# EAGLE board AQ_sensor_GSM (EAGLE 9.6.2)
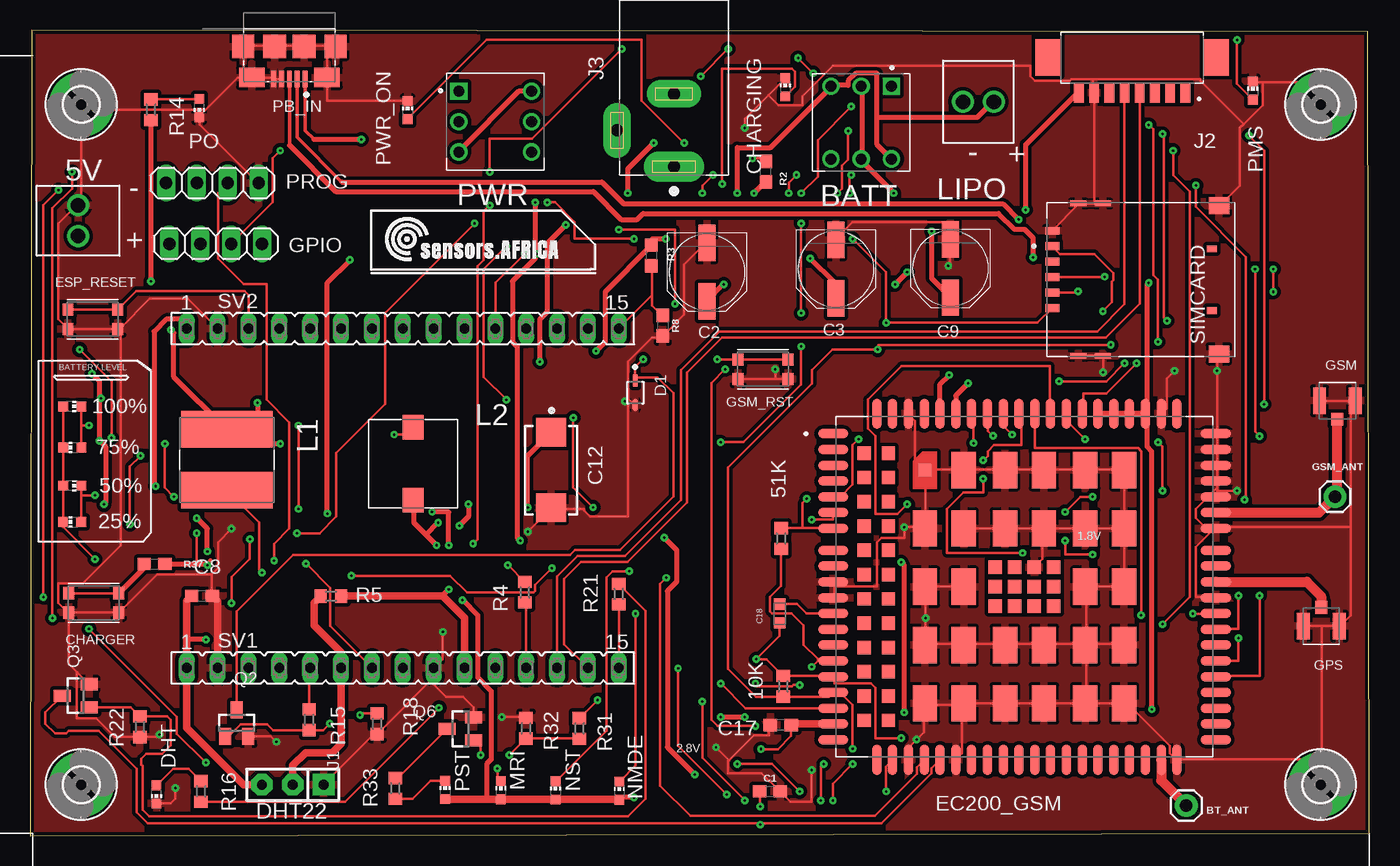
[diagram p5: board, top side]
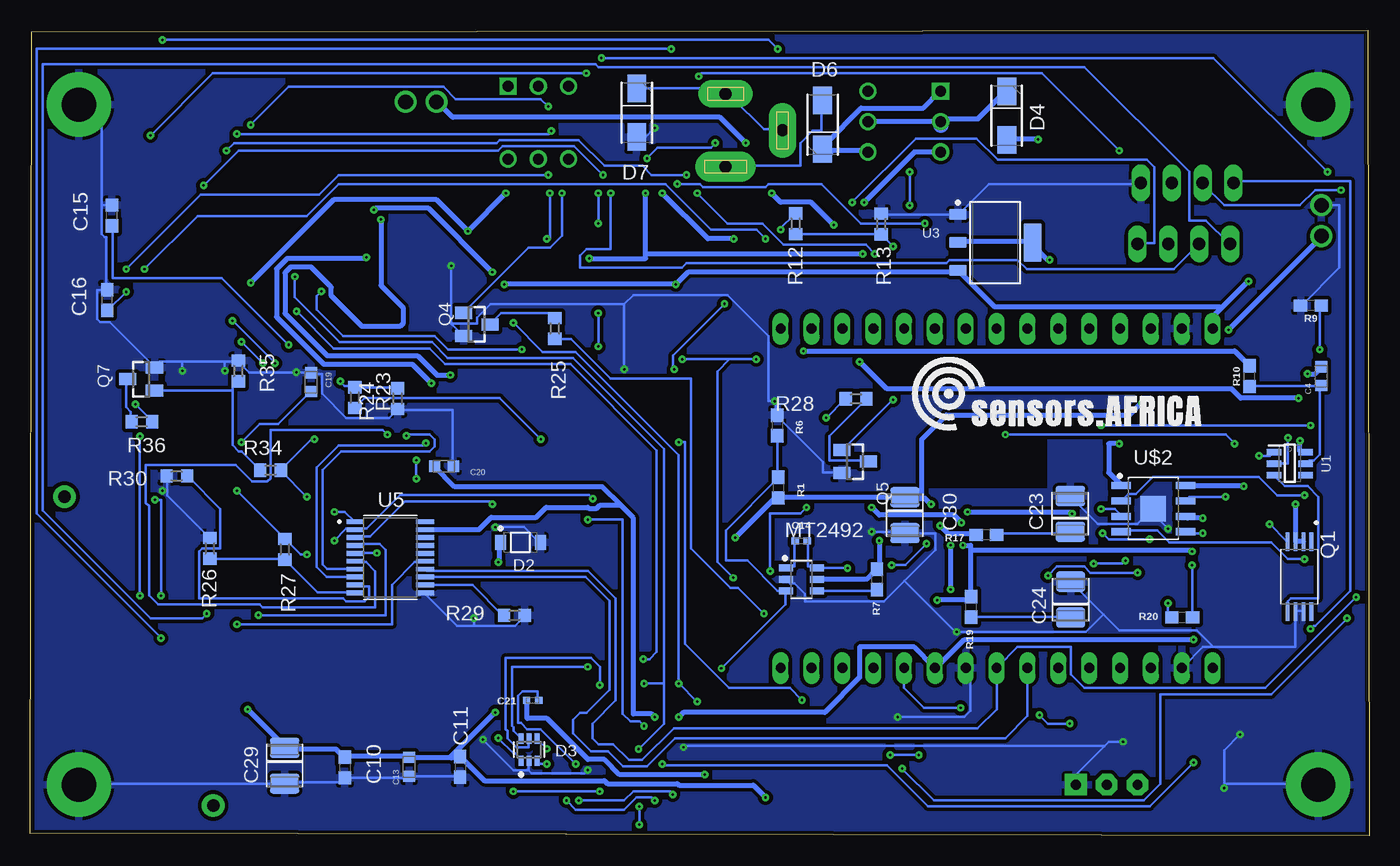
[diagram p6: board, bottom side, seen from below]

Size 110.2 x 66.3 mm. Coordinates in mm from the lower left corner, seen from the top.
Outline: 110.1,66.2 0.1,66.3 0,0 110.2,0.2 110.1,66.2
Copper layers (1*16): Top 0.035mm / dielectric 1.5mm / Bottom 0.035mm
Design rules "default *": minimum track width 0.1mm, minimum drill 0.15mm, track to track 0.3mm, track to pad 0.1mm, pad to pad 0.2mm, via to via 0.3mm, smd to smd 0.3mm, copper to edge 0.3mm, drill to drill 0.3mm, minimum pad ring 10mil, minimum via ring 8mil, stop-mask expansion 4mil, vias tented up to drill 0mil, thermal gap 10mil
Net classes: 0 default: width 0.2 mm, drill 0.2 mm, clearance 0.2 mm; 1 POWER: width 0.4 mm, drill 0.2 mm, clearance 0.2 mm to class 0, clearance 0.2 mm; 2 BGA: width 0.2 mm, drill 0.2 mm; 3 HCurrent: width 0.4 mm, drill 0.2 mm, clearance 0.2 mm to class 0

## Footprints (pad centres in the part's own frame; a part is rotated, then mirrored left to right if it is on the bottom)
TERMBLK_254-2N = drill 1.2: 1 0,0; 2 2.54,0
R0603 = smd 1 x 1.1: 1 -0.85,0; 2 0.85,0
CHIP-LED0603 = smd 0.8 x 0.8: A 0,-0.75; C 0,0.75
SW_TL2285EE = drill 0.9 square: 1 -2.5,-3 | drill 0.9: 2 0,-3; 3 2.5,-3; 4 -2.5,3; 5 0,3; 6 2.5,3
1X01 = drill 1.016 pad 1.88: 1 0,0
0603 = smd 1.1 x 1: 1 -0.85,0; 2 0.85,0
PANASONIC_D = smd 3 x 1.4: + 2.4,0; - -2.4,0
CAPC1608X90N = smd 0.92 x 0.98: 1 -0.775,0; 2 0.775,0
C0603 = smd 1.1 x 1: 1 -0.85,0; 2 0.85,0
CAPMP7343X430N = smd 2.35 x 2.45: 1 -3.1,0; 2 3.1,0
0402-TIGHT = smd 0.6 x 0.6: 1 -0.5,0; 2 0.5,0
CAP_TANT_B = smd 1.66 x 2.42: 1 -1.475,0; 2 1.475,0
SW_KMR621NGLFS = smd 0.9 x 1: 1_1 -2.05,0.8; 1_2 2.05,0.8; 2_1 -2.05,-0.8; 2_2 2.05,-0.8
ON_SEMI_1N4148WS_0 = smd 1.006 x 0.392: 1 -1,0; 2 1,0
ON_SEMICONDUCTOR_MMSZ5231BT1G_0 = smd 0.91 x 1.22: 1 -1.635,0; 2 1.635,0
SEMTECH_SMF05C_0 = smd 0.85 x 0.4: 1 -0.925,0.65; 2 -0.925,0; 3 -0.925,-0.65; 4 0.925,-0.65; 5 0.925,0; 6 0.925,0.65
DIOM5025X220N = smd 2.25 x 1.55: 1 -2,0; 2 2,0
XCVR_EC200UCNAB-N05-SNNSA = smd 2.5 x 0.8: 1 -15.75,12.6; 2 -15.75,11.3; 3 -15.75,10; 4 -15.75,8.7; 5 -15.75,7.4; 6 -15.75,6.1; 7 -15.75,4.8; 8 -15.75,0.4; 9 -15.75,-0.9; 10 -15.75,-2.2; 11 -15.75,-3.5; 12 -15.75,-4.8; 13 -15.75,-6.1; 14 -15.75,-7.4; 15 -15.75,-8.7; 16 -15.75,-10; 17 -15.75,-11.3; 18 -15.75,-12.6; 37 15.75,-12.6; 38 15.75,-11.3; 39 15.75,-10; 40 15.75,-8.7; 41 15.75,-7.4; 42 15.75,-6.1; 43 15.75,-4.8; 44 15.75,-3.5; 45 15.75,-2.2; 46 15.75,-0.9; 47 15.75,0.4; 48 15.75,4.8; 49 15.75,6.1; 50 15.75,7.4; 51 15.75,8.7; 52 15.75,10; 53 15.75,11.3; 54 15.75,12.6; 141 -15.75,3; 142 -15.75,1.7; 143 15.75,1.7; 144 15.75,3 | smd 0.8 x 2.5: 19 -9.55,-14.25; 20 -8.25,-14.25; 21 -6.95,-14.25; 22 -5.65,-14.25; 23 -4.35,-14.25; 24 -3.05,-14.25; 25 -1.75,-14.25; 26 -0.45,-14.25; 27 0.85,-14.25; 28 2.15,-14.25; 29 3.45,-14.25; 30 4.75,-14.25; 31 6.05,-14.25; 32 7.35,-14.25; 33 8.65,-14.25; 34 9.95,-14.25; 35 11.25,-14.25; 36 12.55,-14.25; 55 12.55,14.25; 56 11.25,14.25; 57 9.95,14.25; 58 8.65,14.25; 59 7.35,14.25; 60 6.05,14.25; 61 4.75,14.25; 62 3.45,14.25; 63 2.15,14.25; 64 0.85,14.25; 65 -0.45,14.25; 66 -1.75,14.25; 67 -3.05,14.25; 68 -4.35,14.25; 69 -5.65,14.25; 70 -6.95,14.25; 71 -8.25,14.25; 72 -9.55,14.25; 113 -10.85,14.25; 114 -12.15,14.25; 115 -10.85,-14.25; 116 -12.15,-14.25 | smd 1.1 x 1.1: 73 2.4,1.6; 74 2.4,0; 75 2.4,-1.6; 76 0.8,1.6; 77 0.8,0; 78 0.8,-1.6; 79 -0.8,1.6; 80 -0.8,0; 81 -0.8,-1.6; 82 -2.4,1.6; 83 -2.4,0; 84 -2.4,-1.6; 117 -11.2,11; 118 -11.2,9; 119 -11.2,7; 120 -11.2,5; 121 -11.2,3; 122 -11.2,1; 123 -11.2,-1; 124 -11.2,-3; 125 -11.2,-5; 126 -11.2,-7; 127 -11.2,-9; 128 -11.2,-11; 129 -13.2,11; 130 -13.2,9; 131 -13.2,7; 132 -13.2,5; 133 -13.2,3; 134 -13.2,1; 135 -13.2,-1; 136 -13.2,-3; 137 -13.2,-5; 138 -13.2,-7; 139 -13.2,-9; 140 -13.2,-11 | smd 2 x 3: 85 8.2,9.6; 86 8.2,4.8; 87 8.2,0; 88 8.2,-4.8; 89 8.2,-9.6; 90 5,9.6; 91 5,4.8; 92 5,0; 93 5,-4.8; 94 5,-9.6; 95 1.6,9.6; 96 1.6,4.8; 97 1.6,-4.8; 98 1.6,-9.6; 99 -1.6,9.6; 100 -1.6,4.8; 101 -1.6,-4.8; 102 -1.6,-9.6; 103 -5,9.6; 104 -5,4.8; 105 -5,0; 106 -5,-4.8; 107 -5,-9.6; 109 -8.2,4.8; 110 -8.2,0; 111 -8.2,-4.8; 112 -8.2,-9.6 | smd 1 x 1: 108 -8.2,9.6
1X04 = drill 1.016 long: 1 -3.81,0; 2 -1.27,0; 3 1.27,0; 4 3.81,0
TE_1909763-1 = smd 1 x 1.05: 1 0,-1.525 | smd 1.05 x 2.2: 2 -1.475,0; 3 1.475,0
2,8-PAD = drill 2.8 pad 5.334: B2,8 0,0
SIP-100-03-32 = drill 0.813 pad 1.778 square: 1 -2.54,0 | drill 0.813 pad 1.778 octagon: 2 0,0; 3 2.54,0
MOLEX_53261-0871 = smd 0.8 x 1.6: 1 -4.375,2.9; 2 -3.125,2.9; 3 -1.875,2.9; 4 -0.625,2.9; 5 0.625,2.9; 6 1.875,2.9; 7 3.125,2.9; 8 4.375,2.9 | smd 2.1 x 3: S1 -6.925,0; S2 6.925,0
CUI_PJ-002BH = drill 1 pad 2.5 long: 1 0,0 | drill 1 pad 2.25 long: 2 6,0; 3 3,4.7
784787047 = smd 7.5 x 3: 1 0,2.5; 2 0,-2.5
784778010 = smd 1.7 x 2: 1 0,3; 2 0,-3
SOT95P280X145-6N = smd 1.172 x 0.589: 1 -1.272,0.95; 2 -1.272,0; 3 -1.272,-0.95; 4 1.272,-0.95; 5 1.272,0; 6 1.272,0.95
AMPHENOL_10118192-0001LF = smd 0.4 x 1.35: 1 -1.3,0; 2 -0.65,0; 3 0,0; 4 0.65,0; 5 1.3,0 | smd 2.1 x 1.6: SH1 -3.1,-0.125; SH2 3.1,-0.125 | smd 1.8 x 1.9: SH3 -3.8,-2.675; SH6 3.8,-2.675 | smd 1.9 x 1.9: SH4 -1.2,-2.675; SH5 1.2,-2.675
SOP65P640X120-8N = smd 1.56 x 0.4: 1 -2.88,0.975; 2 -2.88,0.325; 3 -2.88,-0.325; 4 -2.88,-0.975; 5 2.88,-0.975; 6 2.88,-0.325; 7 2.88,0.325; 8 2.88,0.975
SOT23-BEC = smd 1 x 1.4: B -0.95,-1.1; C 0,1.1; E 0.95,-1.1
MOLEX_78646-3001 = smd 1.15 x 0.65: C1 -7.295,2.755; C2 -7.295,0.215; C3 -7.295,-2.325; C5 -7.295,4.025; C6 -7.295,1.485; C7 -7.295,-1.055 | smd 1.3 x 0.45: G1 -5.125,6.27; G2 -3.125,6.27; G3 -5.125,-6.27; G4 -3.125,-6.27 | smd 1.7 x 1.4: G5 6.435,-6.105; G6 6.435,6.105 | smd 0.8 x 0.54: X1 5.855,2.54; X2 5.855,-2.54
FE15 = drill 0.813 long: 1 -17.78,0; 2 -15.24,0; 3 -12.7,0; 4 -10.16,0; 5 -7.62,0; 6 -5.08,0; 7 -2.54,0; 8 0,0; 9 2.54,0; 10 5.08,0; 11 7.62,0; 12 10.16,0; 13 12.7,0; 14 15.24,0; 15 17.78,0
SOT23-6L = smd 0.55 x 1.2: 1 -0.95,-1.3; 2 0,-1.3; 3 0.95,-1.3; 4 0.95,1.3; 5 0,1.3; 6 -0.95,1.3
TEXAS_INSTRUMENTS_LM1117IMP-3.3-NOPB_0 = smd 1.45 x 0.9: 1 -3.075,2.3; 2 -3.075,0; 3 -3.075,-2.3 | smd 1.45 x 3.15: 4 3.075,0
SOP65P640X120-20N = smd 1.57 x 0.41: 1 -2.87,2.925; 2 -2.87,2.275; 3 -2.87,1.625; 4 -2.87,0.975; 5 -2.87,0.325; 6 -2.87,-0.325; 7 -2.87,-0.975; 8 -2.87,-1.625; 9 -2.87,-2.275; 10 -2.87,-2.925; 11 2.87,-2.925; 12 2.87,-2.275; 13 2.87,-1.625; 14 2.87,-0.975; 15 2.87,-0.325; 16 2.87,0.325; 17 2.87,0.975; 18 2.87,1.625; 19 2.87,2.275; 20 2.87,2.925
SOIC127P600X165-9T209N = smd 1.609 x 0.594: 1 -2.653,1.905; 2 -2.653,0.635; 3 -2.653,-0.635; 4 -2.653,-1.905; 5 2.653,-1.905; 6 2.653,-0.635; 7 2.653,0.635; 8 2.653,1.905 | smd 2.09 x 2.09: 9 0,0

## Placement (x,y rotation side)
5V  2828XX-2282834-2  [TERMBLK_254-2N]  3.93,49.37 90 top
10K  4.7K  [R0603]  61.97,12.29 90 top
25%  ORANGE  [CHIP-LED0603]  3.44,25.83 90 top
50%  ORANGE  [CHIP-LED0603]  3.46,28.8 270 top
51K  4.7K  [R0603]  61.79,24.46 90 top
75%  ORANGE  [CHIP-LED0603]  3.46,31.96 90 top
100%  ORANGE  [CHIP-LED0603]  3.46,35.34 270 top
BATT  TL2285EE  [SW_TL2285EE]  68.39,58.71 180 top
BT_ANT  [1X01]  95.14,2.48 180 top
C1  10nF  [0603]  60.88,3.64 0 top
C2  100uF  [PANASONIC_D]  55.68,46.39 270 top
C3  100uF  [PANASONIC_D]  66.3,46.65 270 top
C4  100nf  [CAPC1608X90N]  3.94,37.82 90 bottom
C8  10uF  [C0603]  14.13,19.74 0 top
C9  100uF  [PANASONIC_D]  75.72,46.7 270 top
C10  33pF  [C0603]  84.31,5.61 270 bottom
C11  10pF  [C0603]  74.82,5.66 270 bottom
C12  470uf  [CAPMP7343X430N]  42.85,30.1 270 top
C13  100nf  [CAPC1608X90N]  79.03,5.67 90 bottom
C14  22nF  [0402-TIGHT]  46.75,24.27 0 bottom
C15  33pF  [C0603]  103.49,51.07 90 bottom
C16  33pF  [C0603]  103.87,44.09 90 bottom
C17  33pF  [C0603]  61.77,9.1 180 top
C18  100nf  [CAPC1608X90N]  61.68,18.29 270 top
C19  100nf  [CAPC1608X90N]  87.08,37.33 270 bottom
C20  100nf  [CAPC1608X90N]  76.16,30.41 180 bottom
C21  22pF  [0402-TIGHT]  68.86,11.15 0 bottom
C23  TAJB106K016RNJ  [CAP_TANT_B]  24.6,26.49 90 bottom
C24  TAJB106K016RNJ  [CAP_TANT_B]  24.57,19.43 90 bottom
C29  TAJB106K016RNJ  [CAP_TANT_B]  89.27,5.75 270 bottom
C30  TAJB106K016RNJ  [CAP_TANT_B]  38.21,26.39 270 bottom
CHARGER  KMR621NGLFS  [SW_KMR621NGLFS]  5.22,19.16 0 top
CHARGING  ORANGE  [CHIP-LED0603]  62.14,61.62 0 top
D1  ON_SEMI_1N4148WSON_SEMI_1N4148WS_0_0  [ON_SEMI_1N4148WS_0]  49.79,36.47 270 top
D2  ON_SEMICONDUCTOR_MMSZ5231BT1GON_SEMICONDUCTOR_MMSZ5231BT1G_0_0  [ON_SEMICONDUCTOR_MMSZ5231BT1G_0]  69.86,24.14 0 bottom
D3  SEMTECH_SMF05CSEMTECH_SMF05C_0_0  [SEMTECH_SMF05C_0]  69.15,7.08 90 bottom
D4  SS54-HF  [DIOM5025X220N]  29.82,59.28 270 bottom
D6  SS54-HF  [DIOM5025X220N]  44.99,58.52 90 bottom
D7  SS54-HF  [DIOM5025X220N]  60.29,59.52 270 bottom
DHT  GREEN  [CHIP-LED0603]  10.39,3.4 180 top
EC200_GSM  EC200UCNAB-N05-SNNSA  [XCVR_EC200UCNAB-N05-SNNSA]  81.83,20.49 0 top
ESP_RESET  KMR621NGLFS  [SW_KMR621NGLFS]  5.14,42.52 180 top
GPIO  PINHD-1X4  [1X04]  15.25,48.73 0 top
GPS  1909763-1  [TE_1909763-1]  106.26,17.26 180 top
GSM  1909763-1  [TE_1909763-1]  107.59,35.81 0 top
GSM_ANT  [1X01]  107.39,27.9 180 top
GSM_RST  KMR621NGLFS  [SW_KMR621NGLFS]  60.31,38.4 180 top
H1  MOUNT-PAD-ROUND2.8  [2,8-PAD]  4.2,60.2 180 top
H2  MOUNT-PAD-ROUND2.8  [2,8-PAD]  4.2,4.2 180 top
H3  MOUNT-PAD-ROUND2.8  [2,8-PAD]  106.2,4.2 180 top
H4  MOUNT-PAD-ROUND2.8  [2,8-PAD]  106.2,60.2 180 top
J1  F-1X03-SIP-100-32  [SIP-100-03-32]  21.6,4.2 180 top
J2  53261-0871  [MOLEX_53261-0871]  90.69,64.06 180 top
J3  PJ-002BH  [CUI_PJ-002BH]  52.98,55.07 90 top
L1  784787047  [784787047]  16.18,30.94 180 top
L2  784778010  [784778010]  31.51,30.62 0 top
LIPO  2828XX-2282834-2  [TERMBLK_254-2N]  79.31,60.42 180 top
MRI  ORANGE  [CHIP-LED0603]  38.73,3.75 0 top
MT2492  MT2492  [SOT95P280X145-6N]  46.73,21.1 0 bottom
NMDE  ORANGE  [CHIP-LED0603]  48.47,3.69 0 top
NST  ORANGE  [CHIP-LED0603]  43.22,3.73 0 top
PB_IN  10118192-0001LF  [AMPHENOL_10118192-0001LF]  21.32,62.3 180 top
PMS  ORANGE  [CHIP-LED0603]  100.63,61.35 0 top
PO  RED  [CHIP-LED0603]  13.91,59.91 180 top
PROG  PINHD-1X4  [1X04]  14.98,53.74 0 top
PST  ORANGE  [CHIP-LED0603]  34.13,3.76 0 top
PWR  TL2285EE  [SW_TL2285EE]  38.27,58.79 270 top
PWR_ON  ORANGE  [CHIP-LED0603]  31.05,59.73 0 top
Q1  FS8205A  [SOP65P640X120-8N]  5.74,21.32 270 bottom
Q2  MMBT2222  [SOT23-BEC]  16.98,9.28 0 top
Q3  MMBT2222  [SOT23-BEC]  3.73,11.52 90 top
Q4  MMBT2222  [SOT23-BEC]  73.45,42.09 270 bottom
Q5  MMBT2222  [SOT23-BEC]  42.31,30.8 270 bottom
Q6  MMBT2222  [SOT23-BEC]  35.4,8.79 90 top
Q7  MMBT2222  [SOT23-BEC]  101.09,37.58 90 bottom
R1  110k  [0603]  48.63,28.66 270 bottom
R2  1k  [0603]  60.54,54.67 90 top
R3  47k  [0603]  51.1,47.77 270 top
R4  470  [R0603]  40.71,20.04 270 top
R5  4.7K  [R0603]  24.74,19.72 180 top
R6  15  [0603]  48.72,33.77 270 bottom
R7  10k  [0603]  40.5,21.09 90 bottom
R8  10k  [0603]  52.05,41.99 270 top
R9  1k  [0603]  4.79,43.65 180 bottom
R10  100R  [0603]  9.84,37.82 90 bottom
R12  4.7K  [R0603]  47.21,50.39 270 bottom
R13  47K  [R0603]  40.16,50.36 270 bottom
R14  1K  [R0603]  9.93,59.76 270 top
R15  4.7K  [R0603]  22.94,9.54 270 top
R16  470  [R0603]  14.05,3.65 270 top
R17  2R  [0603]  31.51,24.76 180 bottom
R18  47K  [R0603]  28.54,9.21 90 top
R19  2R  [0603]  32.76,18.83 90 bottom
R20  220R  [0603]  15.39,17.98 0 bottom
R21  4.7K  [R0603]  48.42,19.88 90 top
R22  47K  [R0603]  9.02,8.96 90 top
R23  4.7K  [R0603]  83.5,36.07 90 bottom
R24  47K  [R0603]  79.98,35.98 90 bottom
R25  470R  [R0603]  67.03,41.76 270 bottom
R26  120K  [R0603]  95.41,23.66 90 bottom
R27  10K  [R0603]  89.25,23.57 270 bottom
R28  470R  [R0603]  42.24,35.96 180 bottom
R29  51K  [R0603]  70.35,18.13 0 bottom
R30  51K  [R0603]  98.14,29.61 180 bottom
R31  4.7K  [R0603]  45.2,8.82 270 top
R32  47K  [R0603]  40.8,8.84 270 top
R33  470R  [R0603]  30.03,3.89 270 top
R34  4.7K  [R0603]  90.43,30.08 180 bottom
R35  47K  [R0603]  93.09,38.26 270 bottom
R36  470R  [R0603]  101.02,34.07 0 bottom
R37  10k  [0603]  10.22,22.36 0 top
SIMCARD  78646-3001  [MOLEX_78646-3001]  91.4,45.77 0 top
SV1  ZX-PM2.54-1-15PY  [FE15]  30.66,13.8 0 top
SV2  ZX-PM2.54-1-15PY  [FE15]  30.66,41.74 0 top
U1  DW01-P  [SOT23-6L]  6.54,30.62 270 bottom
U3  TEXAS_INSTRUMENTS_LM1117IMP-3.3-NOPBTEXAS_INSTRUMENTS_LM1117IMP-3.3-NOPB_0_0  [TEXAS_INSTRUMENTS_LM1117IMP-3.3-NOPB_0]  30.77,48.83 0 bottom
U5  TXS0108EPWR  [SOP65P640X120-20N]  80.58,22.92 0 bottom
U$2  [SOIC127P600X165-9T209N]  17.77,26.92 0 bottom

## Tracks (layer width: path | path; a pad name or v marks a point on that pad's centre or on a via)
4.5-16V  (via drill 0.2)
  Top 0.4: v59.56,52.9 60.44,53.77 R2.1 | v64.19,47.52 66.19,45.52 66.19,44.27 C3.+ | PWR.3 35.31,56.4 40.19,61.27 41.19,61.27 PWR.4 | v40.31,24.27 40.06,24.52 40.06,40.27 39.69,40.65 39.69,45.65 41.56,47.52 41.56,47.9 | v41.56,52.15 41.56,47.9 | v41.69,47.9 41.56,47.9
  Bottom 0.4: 59.56,47.9 59.56,47.52 v64.19,47.52 | 59.56,47.9 v59.56,52.9 | MT2492.5 45.44,21.15 41.31,21.15 40.56,21.9 R7.2 40.31,22.02 v40.31,24.27 | v41.56,52.15 37.44,56.27 35.31,56.27 PWR.3 | v41.69,47.9 59.56,47.9
5V_IN  (via drill 0.2)
  Top 0.4: v20.56,32.27 16.19,32.27 16.19,33.4 L1.2 | v11.56,41.65 11.81,41.4 11.81,37.77 16.06,33.52 L1.2 | v35.31,25.52 36.06,26.27 v36.06,27.27 | v54.69,5.02 52.44,7.27 52.44,20.15 53.19,20.9 53.19,23.52 v52.19,24.52 | v18.69,35.65 18.69,32.4 L1.2
  Bottom 0.4: v20.56,32.27 21.44,32.27 21.44,29.9 20.44,28.9 U$2.1 | v11.56,41.65 3.94,49.27 5V.1 | v35.31,25.52 34.69,24.9 32.56,24.9 32.44,24.77 R17.2 | v36.06,27.27 36.56,27.77 36.81,27.77 | 36.81,27.77 38.19,27.77 C30.1 38.31,27.9 48.56,27.9 R1.2 48.69,27.77 48.94,27.77 v52.19,24.52 | v54.69,5.02 61.69,5.02 62.94,6.27 64.31,6.27 67.69,9.65 69.31,9.65 69.31,11.02 C21.1 | v18.69,35.65 19.69,34.65 34.81,34.65 36.81,32.65 36.81,27.77
5V_OUT  (via drill 0.2)
  Top 0.4: v81.94,51.52 81.94,56.9 86.19,61.15 J2.8 | v71.19,45.4 v72.19,46.4 | v57.06,45.4 55.69,44.02 C2.+ | v9.94,45.65 9.94,58.9 R14.2 | v10.31,28.77 10.19,28.9 10.19,41.52 11.19,42.52 12.81,42.52 12.81,41.77 SV2.1
  Bottom 0.4: v81.94,51.52 81.81,51.65 77.44,51.65 v72.19,46.4 | v71.19,45.4 v57.06,45.4 56.06,46.4 33.94,46.4 U3.3 33.81,46.52 30.81,43.52 12.31,43.52 12.19,43.4 | 12.19,43.4 12.81,42.77 12.81,41.77 SV2.1 | 12.19,43.4 v9.94,45.65 | v10.31,28.77 15.06,28.77 U$2.8
5VT
  Bottom 0.4: D4.1 29.94,61.27 32.19,59.02 34.69,59.02 PWR.2 35.81,58.77 41.19,58.77 PWR.5
  Bottom 1.27: 35.27,58.51 PWR.2
+3V3  (via drill 0.2)
  Top 0.4: v56.81,9.77 v58.81,9.77 | v26.31,47.4 24.44,45.52 v24.44,26.52 | v33.06,26.65 34.44,26.65 v34.44,23.9 | v34.44,20.27 34.06,19.9 33.94,19.72 | v14.44,16.15 12.88,16.15
  Top 0.6: C8.1 12.88,19.34 12.88,16.15 SV1.1 12.88,8.88 17.56,4.2 J1.3 | R5.1 33.94,19.72 35.74,17.92 SV1.10
  Bottom 0.4: U3.2 33.81,48.9 27.81,48.9 U3.4 27.69,48.65 26.44,47.4 v26.31,47.4 | 61.64,27.22 60.56,26.15 60.56,10.02 59.06,10.02 v58.81,9.77 | 61.64,27.22 63.14,28.72 75.26,28.72 76.94,30.4 C20.2 | v56.81,9.77 56.44,10.15 44.81,10.15 41.94,13.02 41.94,15.52 37.44,15.52 35.81,13.9 SV1.10 35.56,13.9 33.31,16.15 v14.44,16.15 | v24.44,26.52 24.56,26.65 v33.06,26.65 | v34.44,20.27 v34.44,23.9 | U5.19 73.28,25.19 72.27,26.2 68.56,26.2 67.74,27.02 64.32,27.02 64.25,26.94 63.58,26.94 63.3,27.22 61.64,27.22
BATT-  (via drill 0.2)
  Top 0.4: v5.06,38.02 5.69,37.4 5.69,36.02 | 5.69,36.02 v5.69,32.52 6.19,32.02 6.19,27.4 v6.06,27.27 | v51.31,57.02 49.19,54.9 v49.19,52.9 | v44.06,50.27 42.56,48.77 42.56,43.15 41.94,42.52 v41.94,39.02 | v5.81,36.02 5.69,36.02
  Bottom 0.4: Q1.2 5.44,24.27 6.06,24.27 Q1.3 v6.06,27.27 | v5.06,38.02 4.44,38.02 3.94,38.52 C4.2 | v5.69,32.52 5.69,31.65 5.31,31.65 U1.6 | v51.31,57.02 53.44,59.15 75.44,59.15 76.69,60.4 LIPO.2 | v49.19,52.9 48.44,52.15 45.94,52.15 v44.06,50.27 | v41.94,39.02 39.69,36.77 11.31,36.77 10.56,36.02 v5.81,36.02
BMSV
  Top 0.2: 51.19,44.52 51.19,46.9 R3.2 | 51.19,44.52 51.19,43.65 51.94,42.9 R8.1 | 51.19,44.52 48.44,41.77 SV2.15
BT_ANT
  Top 0.813: EC200_GSM.35 93.08,4.54 BT_ANT.1
DHT_LED  (via drill 0.2)
  Top 0.2: R16.2 25.91,2.8 v33.64,10.52
  Bottom 0.2: v33.64,10.52 36.64,10.52 38.28,12.16 SV1.11
DHT_OUT
  Top 0.6: R5.2 23.34,19.17 23.34,17.32 25.58,15.08 SV1.6 25.58,7.56 24.84,6.82 22.64,6.82 21.6,5.78 J1.2
  Bottom 0.2: 25.61,13.83 SV1.6
ESP_RST
  Top 0.2: SV2.3 17.96,44.5 17.64,44.82 8.7,44.82 ESP_RESET.2_1 ESP_RESET.2_2
G_ADC0  (via drill 0.2)
  Top 0.2: v95.69,18.27 97.56,18.27 EC200_GSM.45
  Bottom 0.2: v95.69,18.27 96.06,17.9 100.31,17.9 109.19,26.77 109.19,63.52 63.69,63.52 63.44,63.27 23.44,63.27 14.81,54.65 14.81,50.65 13.44,50.65 11.56,48.77 GPIO.1
G_ADC1  (via drill 0.2)
  Top 0.2: v99.44,19.77 99.44,17.02 97.69,17.02 EC200_GSM.44 | v99.94,27.65 100.06,27.77 100.06,47.65 95.94,51.77 v95.94,53.52 | v63.06,54.4 62.44,53.77 v62.44,52.9
  Bottom 0.2: v99.44,19.77 99.44,27.65 v99.94,27.65 | v95.94,53.52 93.06,56.4 71.69,56.4 71.31,56.77 65.44,56.77 v63.06,54.4 | v62.44,52.9 62.44,48.27 64.44,48.27 64.94,47.77 64.94,46.77 56.56,46.77 56.19,47.15 34.81,47.15 34.56,47.4 28.94,47.4 28.19,46.65 16.06,46.65 14.06,48.65 GPIO.2
G_I2C_SCL  (via drill 0.2)
  Top 0.2: v101.19,19.77 101.19,13.15 97.69,13.15 EC200_GSM.41 | v101.19,32.9 100.81,33.27 v100.81,46.65 | v49.69,49.15 44.81,49.15 44.81,50.52 43.19,52.15 v42.56,52.15
  Bottom 0.2: v101.19,32.9 v101.19,19.77 | v100.81,46.65 96.44,51.02 87.44,51.02 84.81,53.65 57.94,53.65 54.19,49.9 50.44,49.9 v49.69,49.15 | v42.56,52.15 37.31,57.4 32.31,57.4 30.56,55.65 18.31,55.65 17.69,55.02 17.69,48.77 19.06,48.77 GPIO.4
G_I2C_SDA  (via drill 0.2)
  Top 0.2: v99.44,16.27 99.44,14.4 97.69,14.4 EC200_GSM.42 | v55.19,62.52 v57.44,64.77 | v20.56,56.4 19.94,55.77 19.94,52.15 16.56,48.77 GPIO.3
  Bottom 0.2: v99.44,16.27 109.69,26.52 109.69,64.77 v57.44,64.77 | v55.19,62.52 54.94,62.77 26.94,62.77 v20.56,56.4
G_USB_BOOT  (via drill 0.2)
  Top 0.2: v70.44,3.65 70.44,5.65 70.94,6.15 EC200_GSM.115 | v63.31,3.65 61.06,5.9 v58.19,5.9 | v14.44,6.02 12.06,8.4 12.06,9.77 v4.81,17.02
  Bottom 0.2: v63.31,3.65 v70.44,3.65 | v58.19,5.9 58.06,5.77 39.69,5.77 36.31,2.4 18.06,2.4 v14.44,6.02 | v4.81,17.02 4.56,17.27 4.44,17.27 1.56,20.15 1.56,53.9 10.94,53.9 11.06,53.77 PROG.1
G_USB_D+  (via drill 0.2)
  Top 0.305: PB_IN.3 21.32,56.84
  Top 0.4: v82.54,47.62 82.54,49.22 81.84,49.92 81.01,49.92 79.7,51.22 50.44,51.22 49.94,50.72 48.64,50.72 46.34,53.02 25.14,53.02 21.32,56.84 | v77.21,37.25 76.18,36.23 EC200_GSM.69
  Bottom 0.4: v77.21,37.25 78.77,38.82 86.06,38.82 89.94,42.71 89.94,46.65 89.06,47.53 82.64,47.53 v82.54,47.62
G_USB_D-  (via drill 0.2)
  Top 0.305: PB_IN.2 21.97,57.49 25.64,53.82
  Top 0.4: 25.64,53.82 47.04,53.82 48.84,52.02 80.04,52.02 v81.34,50.72 | EC200_GSM.70 74.88,37.16 v75.64,37.92
  Bottom 0.4: v81.34,50.72 81.34,45.29 79.54,43.49 79.54,42.16 79.77,41.92 82.9,41.92 85.44,44.45 85.44,45.16 87.11,46.83 88.77,46.83 89.24,46.36 89.24,43 85.77,39.52 78.34,39.52 76.74,37.92 v75.64,37.92
GND  (via drill 0.2)
  Top 0.2: SV1.9 33.2,12.46 34.24,11.42 35.64,11.42 36.5,10.56 Q6.E | CHARGER.2_1 3.17,14.13 3.86,13.44 | 3.86,13.44 Q3.E | CHARGER.2_1 CHARGER.2_2 7.31,18.4 10.44,21.52 14.94,21.52 | v10.64,8.32 10.43,8.12 R22.1 8.94,8.15 6.94,8.15 5.44,9.65 3.81,9.65 3.81,13.4 3.86,13.44 | v11.94,3.92 11.94,3.02 11.57,2.65 DHT.C | Q2.E 19.78,8.18 v20.24,7.72 | SV2.2 12.94,44.22 9.84,44.22 7.34,41.72 ESP_RESET.1_1 | ESP_RESET.1_1 ESP_RESET.1_2 3.06,41.77 2.31,42.52 2.31,50.4 3.81,51.9 5V.2 3.94,52.02 4.19,52.27 4.19,59.77 | GSM_RST.1_1 61.31,37.6 | 61.31,37.6 GSM_RST.1_2 | 60.75,60.96 58.81,59.02 v58.81,58.27 | 60.75,60.96 62.06,62.27 CHARGING.C | SIMCARD.C5 84.19,49.9 86.19,51.9 86.19,52.02 SIMCARD.G1 86.31,52.02 87.56,52.02 | 87.56,52.02 88.19,52.02 SIMCARD.G2 | 87.56,52.02 J2.7 87.44,61.27 87.44,62.27 | 60.75,60.96 61.56,60.15 63.56,60.15 63.56,60.9 66.06,63.4 82.31,63.4 82.31,62.52 82.69,62.15 85.56,62.15 85.69,62.27 87.44,62.27 | SIMCARD.G3 86.31,39.52 88.19,39.52 SIMCARD.G4 88.31,39.4 v88.31,38.15 | v94.19,38.27 93.56,37.65 93.56,35.15 93.19,34.77 EC200_GSM.56 | 101.44,62.02 106.19,62.02 106.19,60.27 H4.B2,8 | 101.44,62.02 100.69,62.02 PMS.C | 99.88,58.58 101.44,60.15 101.44,62.02 | 99.88,58.58 99.56,58.27 99.56,53.52 97.94,51.9 SIMCARD.G6 | 87.44,62.27 96.31,62.27 96.31,62.15 99.88,58.58 | 86.94,10.9 89.94,10.9 EC200_GSM.89 90.06,10.77 90.44,10.77 93.81,7.4 93.81,6.77 94.31,6.27 EC200_GSM.36 94.44,6.27 106.31,6.27 | 57.5,6.21 59.56,8.27 60.81,8.27 60.81,9.02 C17.2 | 57.5,6.21 57.44,6.15 57.44,5.15 60.19,5.15 61.69,3.65 C1.2 61.81,3.52 62.56,2.77 64.31,2.77 v64.31,5.4 | EC200_GSM.19 72.31,6.27 72.31,7.27 v72.94,7.9 73.56,8.52 73.56,10.77 EC200_GSM.112 73.69,10.77 76.69,10.77 EC200_GSM.107
  Top 0.2: EC200_GSM.22 76.19,6.27 76.69,6.77 76.69,10.65 76.81,10.77 EC200_GSM.107 | EC200_GSM.107 76.94,10.9 80.19,10.9 EC200_GSM.102 80.31,10.9 83.31,10.9 EC200_GSM.98 86.81,10.9 EC200_GSM.94 86.94,10.9 | 86.94,15.77 89.94,15.77 EC200_GSM.88 | EC200_GSM.105 76.81,20.52 73.69,20.52 EC200_GSM.110 73.69,20.4 v73.69,17.9 73.69,15.77 | 73.69,15.77 76.81,15.77 EC200_GSM.106 76.94,15.77 80.19,15.77 EC200_GSM.101 80.31,15.77 83.31,15.77 EC200_GSM.97 83.44,15.77 86.81,15.77 EC200_GSM.93 | 73.69,15.77 EC200_GSM.111 | 86.94,15.77 86.94,20.4 EC200_GSM.92 86.94,20.52 89.94,20.52 EC200_GSM.87 90.06,20.52 90.06,25.27 EC200_GSM.86 | 86.94,15.77 EC200_GSM.93 | EC200_GSM.86 89.94,25.27 86.94,25.27 EC200_GSM.91 86.81,25.27 83.44,25.27 EC200_GSM.96 83.31,25.27 | 83.31,25.27 83.31,22.77 82.69,22.15 EC200_GSM.76 | EC200_GSM.104 76.94,25.27 80.19,25.27 EC200_GSM.100 80.31,25.27 83.31,25.27 | 66.19,20.52 66.19,20.77 EC200_GSM.8 66.19,20.52 | 66.19,20.52 66.19,19.65 EC200_GSM.9 | 66.19,20.52 69.69,20.52 69.69,24.15 70.06,24.52 71.94,24.52 v71.94,25.4 73.56,25.4 EC200_GSM.109 73.69,25.4 73.69,30.02 EC200_GSM.108 | EC200_GSM.108 73.69,30.15 76.81,30.15 EC200_GSM.103 76.94,30.15 80.19,30.15 EC200_GSM.99 80.31,30.15 83.31,30.15 EC200_GSM.95 83.44,30.15 86.81,30.15 EC200_GSM.90 86.94,30.15 89.94,30.15 EC200_GSM.85 90.06,30.02 90.06,25.4 EC200_GSM.86 | EC200_GSM.72 72.31,34.65 72.81,34.15 72.81,30.9 73.56,30.15 EC200_GSM.108 | 86.94,10.9 86.94,15.65 EC200_GSM.93 | EC200_GSM.46 97.56,19.65 95.94,19.65 95.94,23.77 97.56,25.4 EC200_GSM.48 | 97.69,28.65 97.69,29.15 EC200_GSM.51 97.69,29.27 97.69,30.4 EC200_GSM.52 97.69,30.52 97.69,31.77 EC200_GSM.53 97.69,31.9 97.69,33.02 EC200_GSM.54 97.69,33.15 v97.69,38.27 97.69,39.52 97.81,39.65 SIMCARD.G5
  Top 0.2: 97.69,28.65 97.69,28.4 | 97.69,28.4 97.69,27.9 EC200_GSM.50 | 97.69,28.4 v99.31,28.4 | 97.69,28.65 95.94,26.9 95.94,26.15 97.06,25.02 EC200_GSM.48 | 108.69,35.77 109.06,35.77 GSM.3 108.69,35.77 | 108.69,35.77 106.19,35.77 GSM.2 | 106.31,17.27 107.69,17.27 GPS.2 107.81,17.27 108.69,18.15 108.69,25.4 | 106.31,17.27 104.81,17.27 GPS.3 | 106.31,6.27 106.31,4.27 H3.B2,8 106.31,6.27 | 106.31,6.27 106.31,17.27 | 108.69,25.4 108.69,35.77 | 108.69,25.4 97.69,25.4 EC200_GSM.48 | 4.19,59.77 4.19,60.15 H1.B2,8 4.19,59.77 | PWR_ON.C 30.94,60.52 24.44,60.52 24.44,62.4 PB_IN.SH1 24.44,62.52 24.44,65.02 | 24.44,65.02 22.56,65.02 PB_IN.SH4 22.44,65.02 20.19,65.02 PB_IN.SH5 20.06,65.02 17.56,65.02 PB_IN.SH6 17.56,64.9 17.56,62.4 | 24.44,65.02 25.06,65.02 PB_IN.SH3 24.44,65.02 | PB_IN.4 20.56,62.27 20.06,62.27 PB_IN.5 19.94,62.4 18.31,62.4 PB_IN.SH2 | 14.38,59.71 17.06,62.4 17.56,62.4 | 14.38,59.71 13.94,59.27 PO.C 13.94,59.15 13.94,58.52 18.69,53.77 PROG.4 | 17.56,62.4 18.19,62.4 PB_IN.SH2 | 17.56,62.4 PB_IN.SH2 | 4.19,59.77 14.31,59.77 14.38,59.71 | v75.56,46.9 75.69,47.02 75.69,49.02 C9.- 75.69,49.15 75.69,50.52 67.69,50.52 66.31,49.15 C3.- | v61.31,38.4 61.31,37.6 | 49.25,35.96 49.19,36.02 49.19,39.02 51.19,41.02 51.94,41.02 R8.2 52.06,41.15 53.81,42.9 53.81,47.02 55.56,48.77 C2.- | 49.25,35.96 49.69,35.52 D1.2 | 49.19,35.77 49.19,35.9 49.25,35.96 | 49.19,35.77 49.19,26.27 46.06,26.27 45.56,26.77 45.56,26.9 42.94,26.9 C12.2 42.81,26.9 v40.94,25.02 | 49.19,35.77 v48.94,35.77 | SV1.9 33.19,13.02 28.56,8.4 R18.1 28.44,8.27 28.19,8.27 24.19,4.27 J1.1 | v38.81,9.77 40.69,9.77 R32.1 | 14.94,21.52 14.94,20.02 C8.2
  Top 0.2: v16.56,25.27 15.44,24.15 15.44,22.02 14.94,21.52 | v33.94,16.77 33.94,14.52 33.31,13.9 SV1.9 | ESP_RESET.1_1 7.31,41.65 7.44,41.52 7.44,23.9 4.31,20.77 2.31,20.77 2.31,19.15 3.06,18.4 CHARGER.2_1 | v56.44,7.27 57.5,6.21
  Top 0.6: C8.2 15.42,19.3 SV1.2
  Bottom 0.2: v10.64,8.32 11.94,7.02 11.94,4.27 | 11.94,4.27 v11.94,3.92 | v20.24,7.72 21.44,7.72 21.79,7.37 | J1.1 24.14,5.02 21.79,7.37 | v58.81,58.27 59.56,57.52 60.19,57.52 D7.2 | C20.1 75.44,30.52 75.44,35.02 79.94,35.02 R24.1 80.06,35.02 80.69,34.4 84.19,34.4 86.19,36.4 86.19,38.02 87.06,38.02 C19.1 87.19,38.15 v88.31,38.15 92.19,38.15 93.06,39.02 R35.1 93.19,39.02 94.19,39.02 | 94.19,39.02 97.69,39.02 | 97.69,39.02 99.56,39.02 99.94,38.65 Q7.E 100.06,38.65 103.69,42.27 104.44,42.27 104.69,42.52 104.69,44.9 103.94,44.9 C16.2 103.94,45.02 103.94,49.27 104.06,49.27 104.31,49.52 104.31,51.9 | 94.19,39.02 v94.19,38.27 | 104.31,51.9 103.56,51.9 C15.2 | 104.31,51.9 104.31,60.15 106.19,60.15 H4.B2,8 | 69.19,5.4 69.19,6.15 D3.2 | 69.19,5.4 70.44,5.4 v72.94,7.9 | v64.31,5.4 64.56,5.15 68.94,5.15 69.19,5.4 | 73.69,17.27 75.06,17.27 77.69,19.9 U5.11 | 73.69,17.27 70.31,17.27 69.56,18.02 R29.2 | v73.69,17.9 73.69,17.27 | v71.94,25.4 69.56,25.4 68.31,24.15 D2.2 | 98.94,28.4 98.94,29.52 R30.2 | 98.94,28.4 98.94,28.02 95.44,24.52 R26.2 | v99.31,28.4 98.94,28.4 | C11.2 74.94,4.9 78.94,4.9 C13.1 79.06,4.77 C10.2 84.44,4.65 84.69,4.4 89.19,4.4 C29.2 89.31,4.27 106.19,4.27 H3.B2,8 | v97.69,38.27 97.69,39.02 | R9.2 5.56,43.65 2.44,46.77 2.44,51.9 3.81,51.9 5V.2 | R13.1 40.06,51.15 33.94,51.15 U3.1 33.81,51.15 31.31,53.65 18.81,53.65 PROG.4 | 75.5,42.08 75.56,42.15 v75.56,46.9 | 75.5,42.08 Q4.E | 61.31,43.77 v61.31,38.4 | 61.31,43.77 72.31,43.77 73.44,42.65 73.44,42.15 75.44,42.15 75.5,42.08 | Q5.E 43.44,29.9 44.94,29.9 44.94,30.77 48.69,34.52 R6.1 48.81,34.65 48.81,35.77 v48.94,35.77 49.44,35.77 49.44,41.15 52.81,44.52 60.56,44.52 61.31,43.77
  Bottom 0.2: 11.94,4.27 4.31,4.27 H2.B2,8 | v38.81,9.77 33.31,9.77 32.81,10.27 32.81,13.77 33.19,13.77 SV1.9 | 38.25,20.96 35.69,23.52 35.69,24.9 38.19,24.9 C30.2 38.31,25.02 v40.94,25.02 | 38.25,20.96 39.94,19.27 46.44,19.27 46.44,19.9 47.31,20.77 47.69,20.77 47.94,21.02 MT2492.2 | C23.2 24.56,27.9 22.31,25.65 19.06,25.65 17.81,26.9 U$2.9 17.94,26.65 v16.56,25.27 | Q1.7 5.44,18.52 6.06,18.52 Q1.6 6.06,15.52 12.81,15.52 | 12.81,15.52 13.69,15.52 15.31,13.9 SV1.2 | 21.88,18.21 20.56,16.9 14.19,16.9 12.81,15.52 | 21.88,18.21 24.56,20.9 C24.2 | 38.25,20.96 34.06,16.77 v33.94,16.77 23.31,16.77 21.88,18.21 | v56.44,7.27 56.31,7.4 21.81,7.4 21.79,7.37
  pour Bottom: 0.34,0.32 109.54,0.32 109.54,65.42 109.54,65.82 109.14,65.82 0.34,65.82
  pour Top: 0.44,0.52 109.64,0.52 109.64,65.82 0.44,65.82
GNSS_ANT
  Top 0.813: EC200_GSM.47 105.07,20.89 106.26,19.7 GPS.1
GSM_ANT
  Top 0.813: EC200_GSM.49 106.08,26.59 GSM_ANT.1 107.59,28.1 GSM.1
GSM_RST  (via drill 0.2)
  Top 0.2: EC200_GSM.20 72.98,5.64 72.98,5.1 69.5,1.62 54.34,1.62 51.84,4.12 51.84,20.72 v52.34,21.22 | 49.79,37.72 D1.1 | v56.54,39.22 56.56,39.2 GSM_RST.2_2 GSM_RST.2_1 | Q2.C 16.98,18.47 21.64,23.12 44.43,23.12 44.83,23.52 48.54,23.52 52.94,27.92 52.94,36.42 51.64,37.72 49.79,37.72 | v50.44,39.22 49.79,38.57 49.79,37.72
  Bottom 0.2: v52.34,21.22 53.64,22.52 53.64,38.22 52.64,39.22 | v56.54,39.22 52.64,39.22 | v50.44,39.22 52.64,39.22
GSM_RST_O
  Top 0.2: R15.1 22.94,13.77 SV1.5
LBV  (via drill 0.2)
  Top 0.4: 69.69,59.15 69.69,56.9 70.81,55.77 BATT.4 | 69.69,59.15 69.69,62.77 67.94,62.77 67.31,62.15 67.31,61.77 65.94,61.77 BATT.3 65.81,61.52 60.94,56.65 58.19,56.65 v58.19,52.9 | 69.69,59.15 77.94,59.15 79.19,60.4 LIPO.1 | v46.56,39.9 47.31,40.65 47.31,44.77 51.06,48.52 R3.1 51.19,48.77 51.19,49.15 v52.31,49.15
  Bottom 0.4: R10.2 11.06,39.9 v46.56,39.9 | v58.19,52.9 54.44,49.15 v52.31,49.15
MAIN_CTS  (via drill 0.2)
  Top 0.2: v91.44,18.15 91.44,31.65 91.19,31.9 82.69,31.9 82.69,34.65 EC200_GSM.64
  Bottom 0.2: v91.44,18.15 80.94,18.15 80.94,23.52 81.44,24.02 83.31,24.02 U5.4
MAIN_DCD  (via drill 0.2)
  Top 0.2: v72.19,27.3 71.39,26.5 69.56,26.5 69.56,32.9 68.94,33.52 68.94,35.9 71.69,38.65 83.94,38.65 83.94,34.77 EC200_GSM.63
  Bottom 0.2: v72.19,27.3 72.39,27.5 79.36,27.5 82.21,24.65 83.44,24.65 U5.3
MAIN_DTR  (via drill 0.2)
  Top 0.2: v80.81,33.02 80.19,33.65 80.19,34.65 EC200_GSM.66
  Bottom 0.2: v80.81,33.02 81.19,33.4 90.44,33.4 90.44,29.4 90.69,29.15 91.94,29.15 93.31,30.52 100.69,30.52 100.69,27.4 100.44,27.15 100.44,19.77 99.69,19.02 91.31,19.02 91.06,18.77 81.81,18.77 81.81,21.77 82.56,22.52 83.44,22.52 U5.6
MAIN_RI  (via drill 0.2)
  Top 0.2: v86.81,32.65 85.31,34.15 85.31,34.65 EC200_GSM.62 | v85.19,26.65 86.44,27.9 v87.44,27.9
  Bottom 0.2: v86.81,32.65 87.06,32.65 89.56,30.15 R34.1 89.56,30.02 v87.44,27.9 | v85.19,26.65 84.31,26.65 83.56,25.9 U5.1
MAIN_RTS  (via drill 0.2)
  Top 0.2: v81.69,23.27 75.44,23.27 75.44,26.9 76.81,28.27 78.44,28.27 v78.44,29.4 | v78.44,30.9 78.81,31.27 78.81,31.65 79.31,32.15 81.56,32.15 81.56,34.52 81.44,34.65 EC200_GSM.65
  Bottom 0.2: v81.69,23.27 83.44,23.27 U5.5 | v78.44,30.9 v78.44,29.4
MAIN_RXD  (via drill 0.2)
  Top 0.2: v77.64,32.32 77.64,34.58 EC200_GSM.68
  Bottom 0.2: U5.8 85.81,21.29 86.64,22.12 86.64,30.32 84.84,32.12 77.84,32.12 v77.64,32.32
MAIN_TXD  (via drill 0.2)
  Top 0.2: EC200_GSM.67 78.84,34.68 78.84,33.32 v79.24,32.92
  Bottom 0.2: U5.7 85.75,21.94 86.14,22.33 86.14,30.12 84.63,31.62 77.35,31.62 76.94,32.03 76.94,32.61 77.35,33.03 79.14,33.03 v79.24,32.92
MCU_DTR  (via drill 0.2)
  Top 0.2: v93.19,17.4 95.44,19.65 95.44,53.02 94.06,54.4 v94.06,56.4 | v56.19,54.4 55.31,53.52 v55.31,52.9 | v40.69,47.9 38.31,45.52 38.31,41.77 SV2.11
  Bottom 0.2: v93.19,17.4 80.44,17.4 80.44,20.65 78.56,22.52 77.81,22.52 U5.15 | v94.06,56.4 93.44,57.02 71.81,57.02 71.56,57.27 65.06,57.27 62.94,55.15 59.81,55.15 59.06,54.4 v56.19,54.4 | v55.31,52.9 52.81,50.4 49.94,50.4 48.19,48.65 41.44,48.65 v40.69,47.9
MCU_RXD  (via drill 0.2)
  Top 0.2: v2.31,53.15 1.06,51.9 v1.06,19.65
  Bottom 0.2: U5.14 77.56,21.8 64.31,21.8 62.04,19.53 62.04,11.12 63.94,9.22 63.94,8.02 63.44,7.52 62.24,7.52 60.94,6.22 59.84,6.22 57.24,8.82 32.24,8.82 30.66,10.4 SV1.8 30.56,13.9 28.94,15.52 24.56,15.52 24.56,13.27 23.44,12.15 8.56,12.15 v1.06,19.65 | v2.31,53.15 4.44,53.15 5.69,51.9 11.94,51.9 13.69,53.65 PROG.2
MCU_TXD  (via drill 0.2)
  Top 0.2: v20.06,22.65 20.06,24.02 21.31,25.27 21.31,34.02 19.44,35.9 19.44,45.4 17.56,45.4 15.44,47.52 15.44,52.9 16.19,53.65 PROG.3 | v22.69,22.4 24.69,20.4 24.69,17.27 28.06,13.9 SV1.7
  Bottom 0.2: U5.13 64.51,21.29 62.54,19.32 62.54,12.02 64.44,10.12 64.94,10.12 65.54,9.52 65.54,8.42 64.04,6.92 62.64,6.92 61.44,5.72 59.44,5.72 57.14,8.02 29.94,8.02 28.12,9.84 SV1.7 | v20.06,22.65 20.31,22.4 v22.69,22.4
N$1  (via drill 0.2)
  Top 0.2: Q2.B 16.31,8.18 17.31,9.18 19.49,9.18 19.98,8.69 R15.2 24.1,8.69 v24.64,9.22 | v27.14,9.92 27.27,10.06 R18.2
  Bottom 0.2: v24.64,9.22 26.44,9.22 v27.14,9.92
N$2
  Top 0.2: Q3.B 8.26,10.57 R22.2 11.25,9.82 11.54,9.52 11.54,7.42 10.84,6.72 9.54,6.72 9.14,6.32 9.14,5.83 9.24,5.73 9.24,2.13 9.79,1.58 49.19,1.58 50.64,3.02 50.64,18.51 R21.2
N$3
  Bottom 0.2: C14.1 47.31,24.15 47.31,22.15 47.94,22.15 MT2492.1
N$4  (via drill 0.2)
  Top 0.2: v99.31,65.52 99.31,61.9 100.56,60.65 PMS.A | v48.69,64.77 41.31,57.4 37.81,57.4 v37.81,54.65 | v37.81,51.9 37.31,51.4 37.31,47.4 36.81,46.9 36.81,24.4 v36.44,24.02 | v39.31,22.27 40.69,20.9 R4.1
  Bottom 0.2: v99.31,65.52 49.44,65.52 v48.69,64.77 | v37.81,51.9 v37.81,54.65 | v36.44,24.02 38.19,22.27 v39.31,22.27
N$6  (via drill 0.2)
  Top 0.2: v42.94,22.02 41.56,20.65 41.56,20.15 41.44,20.02 35.94,20.02 34.56,21.4 v26.44,21.4 | v19.06,21.65 18.81,21.9 18.81,25.77 16.19,28.4 L1.1
  Bottom 0.2: C14.2 46.19,24.15 46.19,22.15 45.56,22.15 MT2492.6 45.44,22.02 v42.94,22.02 | v26.44,21.4 25.69,22.15 23.44,22.15 22.94,21.65 v19.06,21.65
N$9  (via drill 0.2)
  Top 0.2: v9.06,31.27 8.19,30.4 v8.19,25.65
  Bottom 0.2: v9.06,31.27 8.19,31.27 7.94,31.52 U1.1 | v8.19,25.65 6.81,24.27 Q1.4
N$10  (via drill 0.2)
  Top 0.2: v65.31,5.9 65.06,5.65 v65.06,2.9 | v57.31,3.4 53.31,7.4 v53.31,13.77
  Bottom 0.2: R6.2 48.69,32.9 48.69,29.52 R1.1 48.69,29.4 52.94,25.15 52.94,22.65 51.19,22.65 48.69,20.15 48.06,20.15 MT2492.3 48.06,20.02 48.06,19.02 v53.31,13.77 | v65.31,5.9 68.19,8.77 69.31,8.77 69.81,9.27 70.06,9.27 70.06,11.52 69.69,11.9 68.44,11.9 68.44,11.15 C21.2 | v65.06,2.9 61.31,2.9 60.56,3.65 57.56,3.65 v57.31,3.4
N$11
  Bottom 0.2: R7.1 40.56,20.15 45.44,20.15 MT2492.4
N$13
  Bottom 0.2: R17.1 30.56,24.77 30.44,24.9 24.69,24.9 C23.1
N$14  (via drill 0.2)
  Top 0.2: 100%.A 2.69,35.27 2.69,32.02 75%.C 2.69,31.9 2.69,28.9 50%.A 2.69,28.77 2.69,25.9 25%.C 2.69,25.77 2.69,25.4 v5.31,22.77
  Bottom 0.2: v5.31,22.77 6.69,22.77 8.06,24.15 16.44,24.15 17.44,25.15 20.19,25.15 20.31,25.02 U$2.4
N$17  (via drill 0.2)
  Top 0.2: 4.19,28.02 4.19,28.77 50%.C | 4.19,28.02 4.19,25.9 25%.A | 4.19,28.02 v5.31,28.02
  Bottom 0.2: v5.31,28.02 7.56,28.02 9.06,29.52 17.81,29.52 19.19,28.15 19.81,28.15 20.31,27.65 U$2.2
N$18  (via drill 0.2)
  Top 0.2: 4.19,33.77 4.19,35.27 100%.C | 4.19,33.77 4.19,32.02 75%.A | v22.06,33.77 v22.06,26.9 | 4.19,33.77 v4.81,33.77
  Bottom 0.2: v22.06,26.9 20.94,26.9 20.44,26.4 U$2.3 | v4.81,33.77 v22.06,33.77
N$19
  Bottom 0.2: U1.3 6.94,28.77 5.06,28.77 4.19,27.9 4.19,19.52 6.44,19.52 6.69,19.27 6.69,18.52 Q1.5
N$20
  Top 0.2: CHARGER.1_2 CHARGER.1_1
  Top 0.4: CHARGER.1_2 9.37,22.06 R37.1
N$21  (via drill 0.2)
  Top 0.2: v11.81,27.9 11.06,28.65 v11.06,32.27 | v29.94,33.02 31.44,33.02 31.44,33.52 L2.1
  Bottom 0.2: v11.81,27.9 14.81,27.9 15.06,27.65 U$2.7 | v11.06,32.27 11.81,33.02 v29.94,33.02
N$22  (via drill 0.2)
  Top 0.2: v39.19,35.9 37.31,37.77 37.31,46.65 v39.19,48.52
  Bottom 0.2: R12.2 47.19,49.52 40.19,49.52 R13.2 40.06,49.4 v39.19,48.52 | v39.19,35.9 43.31,31.77 Q5.B
N$24
  Bottom 0.2: R19.1 32.69,18.02 24.69,18.02 C24.1
N$25
  Top 0.2: PO.A 13.81,60.65 9.94,60.65 R14.1
N$26  (via drill 0.2)
  Top 0.2: v66.44,52.9 66.81,53.27 66.81,55.15 67.31,55.65 v67.31,58.02 | v93.19,57.77 93.31,57.65 93.31,42.65 v93.56,42.4 | v90.06,38.9 88.56,37.4 v84.69,37.4
  Bottom 0.2: R24.2 80.06,36.9 83.44,36.9 R23.2 83.56,37.02 84.31,37.02 v84.69,37.4 | v66.44,52.9 66.44,49.4 67.44,48.4 69.19,48.4 74.44,43.15 Q4.B | v67.31,58.02 67.56,57.77 v93.19,57.77 | v90.06,38.9 v93.56,42.4
N$27
  Top 0.2: DHT.A 11.76,5.52 13.04,5.52 R16.1
N$28  (via drill 0.2)
  Top 0.2: R31.2 45.19,8.02 40.81,8.02 R32.2 40.69,7.9 v39.44,6.65 | v37.06,6.65 37.06,7.27 36.56,7.77 Q6.B
  Bottom 0.2: v39.44,6.65 v37.06,6.65
N$29
  Bottom 0.2: R25.1 67.06,42.65 67.44,43.02 71.44,43.02 72.31,42.15 Q4.C
N$30  (via drill 0.2)
  Top 0.2: v49.81,18.27 49.81,5.77 48.56,4.52 NMDE.C
  Bottom 0.2: v49.81,18.27 51.94,20.4 52.56,20.4 55.81,23.65 55.81,37.65 62.44,37.65 65.69,40.9 66.94,40.9 R25.2
N$31
  Bottom 0.2: R26.1 95.31,22.77 89.31,22.77 R27.2 89.19,22.65 86.56,20.02 83.69,20.02 83.56,19.9 U5.10
N$32
  Top 0.2: Q6.C 30.25,4.74 R33.1
N$33
  Bottom 0.2: R28.1 41.44,35.9 44.44,32.9 44.44,30.9 41.31,30.9 Q5.C
N$34  (via drill 0.2)
  Top 0.2: v49.31,21.77 47.94,21.77 47.44,21.27 47.44,8.65 43.31,4.52 NST.C | v46.31,27.02 44.69,28.65 v44.69,34.4
  Bottom 0.2: v49.31,21.77 49.31,26.52 46.81,26.52 v46.31,27.02 | v44.69,34.4 43.19,35.9 R28.2
N$35  (via drill 0.2)
  Top 0.2: v53.81,57.02 50.31,60.52 50.31,65.52 37.56,65.52 31.06,59.02 PWR_ON.A | v59.44,55.77 60.44,55.77 60.44,55.65 R2.2
  Bottom 0.2: v53.81,57.02 54.19,56.65 58.56,56.65 v59.44,55.77
N$37
  Bottom 0.2: 4.06,37.02 9.81,37.02 R10.1 | 4.06,37.02 3.94,37.02 C4.1 4.06,37.02 | 4.06,37.02 4.06,31.4 4.56,30.9 4.94,30.9 5.19,30.65 U1.5
N$39
  Top 0.2: R33.2 31.46,3.04 32.93,4.51 PST.C
N$40
  Bottom 0.2: R30.1 97.19,29.52 94.56,26.9 94.56,23.65 96.06,23.65 96.31,23.4 96.31,19.52 84.44,19.52 84.19,19.27 82.69,19.27 82.31,19.65 82.31,20.52 83.44,20.52 U5.9
N$41
  Bottom 0.2: R29.1 71.31,18.15 73.81,20.65 77.69,20.65 U5.12
N$42
  Bottom 0.2: 93.56,36.65 93.56,37.4 93.19,37.4 R35.2 | 93.56,36.65 93.56,32.15 93.06,31.65 92.81,31.65 91.31,30.15 R34.2 | 93.56,36.65 99.94,36.65 Q7.B
N$43
  Bottom 0.2: R36.1 101.94,34.15 101.94,34.9 102.31,35.27 102.31,37.52 102.19,37.52 Q7.C
N$44  (via drill 0.2)
  Top 0.2: v38.44,5.52 38.44,4.77 38.69,4.52 MRI.C | v1.81,17.9 1.81,51.65 3.44,53.27 v3.44,54.65 | v64.44,62.77 v63.19,64.02 | v100.31,57.65 101.56,56.4 v101.56,35.52
  Bottom 0.2: v38.44,5.52 35.81,2.9 18.56,2.9 17.19,4.27 17.19,11.65 8.06,11.65 v1.81,17.9 | v3.44,54.65 12.81,64.02 v63.19,64.02 | v64.44,62.77 95.19,62.77 v100.31,57.65 | v101.56,35.52 100.19,34.15 R36.2
N$45  (via drill 0.2)
  Top 0.2: v14.56,22.27 14.56,22.36 | 13.69,22.36 v13.69,24.9
  Top 0.4: R37.2 13.69,22.36 14.56,22.36 14.57,22.36 14.84,22.62
  Bottom 0.2: v14.56,22.27 14.56,18.02 R20.2 | v13.69,24.9 15.06,24.9 U$2.5
N$46  (via drill 0.2)
  Top 0.2: v56.94,53.65 56.94,63.15 62.69,63.15 62.94,62.9 62.94,61.65 62.19,60.9 CHARGING.A | v36.56,50.4 29.19,43.02 29.19,35.52 25.19,31.52 25.19,26.27 23.81,24.9 v21.94,24.9 | v18.06,24.4 18.06,22.8 16.56,21.3 v16.56,19.15
  Bottom 0.2: v56.94,53.65 55.06,53.65 54.81,53.4 49.69,53.4 49.44,53.65 45.06,53.65 41.81,50.4 v36.56,50.4 | v21.94,24.9 21.44,24.4 v18.06,24.4 | v16.56,19.15 16.56,18.02 16.31,18.02 R20.1
N$47  (via drill 0.2)
  Top 0.2: v4.06,40.02 6.69,37.4 v6.69,32.77
  Bottom 0.2: v4.06,40.02 4.06,43.52 R9.1 | v6.69,32.77 6.69,30.65 7.81,30.65 U1.2
N$59  (via drill 0.2)
  Top 0.305: PB_IN.1 22.62,58.04 23.34,57.32
  Top 0.4: 23.34,57.32 v27.24,57.32
  Bottom 0.4: v27.24,57.32 29.78,57.32 D4.2
N$60
  Bottom 0.2: D7.1 60.19,61.52 53.94,61.52 J3.2 52.44,60.77 49.81,58.15 48.31,58.15 J3.3
  Bottom 1.27: 53.42,61.52 J3.2
N$61
  Bottom 0.2: D6.2 45.06,60.4 45.06,58.02 45.81,58.02 46.81,57.02 46.81,55.15 52.94,55.15 J3.1
NET_MODE  (via drill 0.2)
  Top 0.2: v68.19,32.65 67.69,32.15 67.69,28.9 66.69,27.9 66.19,27.9 EC200_GSM.5
  Bottom 0.2: v68.19,32.65 71.56,36.02 82.69,36.02 83.44,35.27 R23.1
NETSTAT  (via drill 0.2)
  Top 0.2: v48.44,49.9 53.06,49.9 v53.06,43.77 | v57.19,38.4 56.06,37.27 56.06,9.52 56.56,9.02 v59.69,9.02 | v64.31,26.02 66.06,26.02 66.06,26.52 EC200_GSM.6
  Bottom 0.2: v48.44,49.9 48.44,50.02 47.31,51.15 R12.1 | v53.06,43.77 57.31,39.52 57.31,38.4 v57.19,38.4 | v59.69,9.02 60.06,9.4 60.81,9.4 61.44,10.02 61.44,26.02 v64.31,26.02
PMS_LED
  Top 0.2: SV1.12 40.82,19.09 R4.2
PMS_RX
  Top 0.2: J2.5 90.06,43.75 87.84,41.52 56.74,41.52 53.54,38.32 53.54,27.62 48.94,23.02 45.04,23.02 43.36,21.34 SV1.13
PMS_TX
  Top 0.2: J2.4 91.31,43.79 88.55,41.02 56.95,41.02 54.04,38.12 54.04,27.42 49.15,22.52 45.34,22.52 43.94,21.12 43.94,15.76 SV1.14
PWRKEY  (via drill 0.2)
  Top 0.2: EC200_GSM.21 74.18,5.54 74.18,5.14 70.06,1.02 60.06,1.02 | 60.06,1.02 9.64,1.02 8.74,1.92 8.74,5.52 5.64,8.62 3.14,8.62 2.94,8.42 2.04,8.42 1.24,9.22 1.24,10.13 Q3.C | v60.06,2.4 60.06,3.52 C1.1 | 60.06,1.02 v60.06,0.9
  Bottom 0.2: v60.06,0.9 v60.06,2.4
PWRKEY_0
  Top 0.2: SV1.15 48.44,19.02 R21.1
PWRSTAT  (via drill 0.2)
  Top 0.2: v46.69,11.15 45.31,9.77 R31.1 | v56.81,32.4 58.69,32.4 63.44,37.15 v63.44,40.27 | v63.44,50.4 v63.44,43.02 | v63.44,52.9 64.81,54.27 64.81,57.27 v67.56,60.02 | v92.06,58.52 92.44,58.15 92.44,46.15 92.81,45.77 v92.81,40.65 | v91.06,38.9 88.56,36.4 86.69,36.4 86.69,34.77 EC200_GSM.61
  Bottom 0.2: v46.69,11.15 47.69,12.15 52.69,12.15 56.31,15.77 56.31,32.4 v56.81,32.4 | v63.44,43.02 v63.44,40.27 | v63.44,52.9 v63.44,50.4 | v67.56,60.02 68.19,60.65 75.19,60.65 76.19,61.65 88.94,61.65 v92.06,58.52 | v91.06,38.9 v92.81,40.65
SIMCLK  (via drill 0.2)
  Top 0.2: SIMCARD.C3 82.89,42.23 v70.44,42.23 70.44,46.4 v67.69,49.15 | v56.84,12.52 58.87,10.49 EC200_GSM.16 | v67.69,5.9 66.06,4.27 v66.06,2.9 | v58.81,2.9 55.31,6.4 v55.31,11.02 | v102.31,46.65 v102.31,44.77 | v67.56,54.4 67.44,54.27 v67.44,52.9
  Bottom 0.2: v70.44,42.23 68.04,39.82 65.33,39.82 56.84,31.33 v56.84,12.52 56.81,12.52 v55.31,11.02 | v67.69,5.9 68.19,5.9 68.44,6.15 D3.3 | v66.06,2.9 65.31,2.15 61.31,2.15 60.31,3.15 59.06,3.15 v58.81,2.9 | v102.31,44.77 103.81,43.27 C16.1 | v102.31,46.65 96.19,52.77 86.44,52.77 84.81,54.4 v67.56,54.4 | v67.44,52.9 67.44,49.15 v67.69,49.15
SIMDATA  (via drill 0.2)
  Top 0.2: SIMCARD.C7 86.13,44.72 v86.24,44.82 | v67.69,7.15 67.69,10.77 66.69,11.77 66.19,11.77 EC200_GSM.15 65.73,11.44 10K.1 59.72,11.44 57.44,13.72 57.44,30.32 64.34,37.22 64.34,38.32 66.04,40.03 v69.74,40.03 69.81,40.15 69.81,40.4 v88.94,40.4
  Bottom 0.2: v86.24,44.82 86.64,44.42 86.64,43.32 84.44,41.12 76.93,41.12 75.83,40.03 v69.74,40.03 | v67.69,7.15 68.44,7.9 D3.4 | v88.94,40.4 94.44,45.9 103.44,45.9 103.44,50.15 C15.1
SIMRST  (via drill 0.2)
  Top 0.2: SIMCARD.C2 88.4,45.99 v88.44,46.02 | v60.14,7.12 61.54,7.12 62.62,8.2 C17.1 | v63.31,12.4 62.81,12.4 62.69,12.27 59.69,12.27 v59.69,12.52
  Top 0.6: EC200_GSM.17 62.7,9.19 C17.1
  Bottom 0.2: v88.44,46.02 88.44,44.32 84.74,40.62 77.14,40.62 75.84,39.32 65.54,39.32 58.04,31.82 58.04,12.52 | v60.14,7.12 58.04,9.22 58.04,12.52 | v63.31,12.4 63.31,13.9 64.06,14.65 71.06,14.65 71.06,8.77 70.94,8.65 70.94,8.02 70.19,7.27 69.19,7.27 69.19,7.9 D3.5 | 58.04,12.52 v59.69,12.52
USIM_DET  (via drill 0.2)
  Top 0.2: 51K.1 61.79,20.55 60.89,19.65 60.89,18.48 61.07,18.3 62.66,18.3 63.64,17.32 63.64,15.72 64.83,14.53 | 64.83,14.53 64.97,14.39 EC200_GSM.13 | v64.31,13.9 64.81,14.4 64.81,14.52 64.83,14.53
  Bottom 0.2: v64.31,13.9 70.56,13.9 70.56,9.02 70.44,8.9 70.44,8.65 69.81,8.02 D3.6
USIM_GND
  Top 0.2: C18.1 63.1,19.06 63.87,18.29 EC200_GSM.10
USIM_VDD  (via drill 0.2)
  Top 0.2: SIMCARD.C1 84.75,47.88 87.57,47.88 89.14,46.31 89.14,45.73 89.04,45.63 89.04,43.93 v88.29,43.18 | C18.2 61.68,16.46 v59.74,14.52 60.59,14.52 10K.2 65.52,13.14 65.57,13.09 EC200_GSM.14 66.19,13.02 66.19,12.52 69.19,12.52 69.56,12.15 69.56,8.02 v71.69,8.02
  Bottom 0.2: v88.29,43.18 85.23,40.12 77.35,40.12 76.05,38.82 65.75,38.82 58.64,31.72 58.64,15.12 59.24,14.52 v59.74,14.52 | v71.69,8.02 70.44,6.77 70.31,6.77 69.81,6.27 D3.1
V_LIPO  (via drill 0.2)
  Top 0.4: 32.56,24.77 31.56,25.77 31.56,27.52 L2.2 | 32.56,24.77 v33.44,23.9 | v13.69,26.15 14.56,25.27 v14.56,23.4 | v40.94,27.02 40.94,31.27 42.81,33.15 C12.1 | 32.56,24.77 v33.56,25.77 | 37.56,3.01 37.56,5.9 37.94,6.27 37.94,11.9 36.81,13.02 36.81,18.15 v35.56,19.4 | BATT.2 68.44,61.65 68.44,55.77 BATT.5 68.44,55.52 v71.06,52.9 | v74.19,49.77 74.19,45.9 75.69,44.4 C9.+ | EC200_GSM.60 87.94,34.77 89.06,34.77 EC200_GSM.59 89.31,34.77 90.31,34.77 EC200_GSM.58 90.56,34.77 91.69,34.77 EC200_GSM.57 | v71.69,22.52 71.94,22.27 v71.94,10.15 | v92.31,10.4 92.31,31.65 91.94,32.02 91.94,34.65 EC200_GSM.57 | v92.06,45.52 91.94,45.4 91.94,34.77 EC200_GSM.57 | v49.69,3.15 48.69,3.15 NMDE.A
  Top 0.6: PST.A 37.56,3.01 38.71,3.01 MRI.A 43.2,3 NST.A 48.44,2.98 NMDE.A
  Bottom 0.4: 32.81,23.52 32.81,23.9 v33.44,23.9 | 32.81,23.52 32.81,19.77 R19.2 32.94,19.65 33.19,19.4 v35.56,19.4 | v13.69,26.15 14.94,26.15 15.06,26.27 U$2.6 | v14.56,23.4 14.69,23.52 32.81,23.52 | v40.94,27.02 40.31,26.4 34.19,26.4 v33.56,25.77 | v71.06,52.9 v74.19,49.77 76.81,52.4 85.19,52.4 v92.06,45.52 | 75.56,6.4 74.94,6.4 C11.1 74.69,6.4 72.81,4.52 62.94,4.52 62.69,4.27 56.94,4.27 56.81,4.15 50.69,4.15 v49.69,3.15 | 75.56,6.4 78.94,6.4 C13.2 79.19,6.52 84.19,6.52 C10.1 84.44,6.52 85.06,7.15 89.19,7.15 C29.1 89.31,7.4 v92.31,10.4 | v71.69,22.52 71.56,22.52 71.56,24.02 D2.1 | v71.94,10.15 75.56,6.52 75.56,6.4
VDD_EXT  (via drill 0.2)
  Top 0.2: 51K.2 63.56,25.31 | 63.56,25.31 66.06,25.31 EC200_GSM.7 | v92.81,32.4 93.19,32.02 v93.19,28.4 | v63.91,27.75 63.56,27.4 63.56,25.31 | v87.44,23.15 85.19,23.15 v85.19,24.27
  Bottom 0.2: v92.81,32.4 91.31,33.9 89.81,33.9 87.19,36.52 C19.2 | v93.19,28.4 89.31,24.52 R27.1 89.19,24.4 87.94,23.15 v87.44,23.15 | v63.91,27.75 64.21,28.05 79.76,28.05 82.54,25.27 83.44,25.27 U5.2 83.56,25.27 84.19,25.27 v85.19,24.27
VUSB
  Bottom 0.4: 44.76,56.29 44.19,56.4 41.31,56.4 PWR.6 | PWR.1 35.31,61.27 36.69,59.9 41.81,59.9 44.69,57.02 D6.1
  Bottom 1.27: D6.1 44.76,56.29
(copper drawn outside any net)
  shapes: Top area x1

## Text on the board
tPlace: - | + | - | + | BATTERY LEVEL
tNames: 1.8V | 2.8V | DHT22